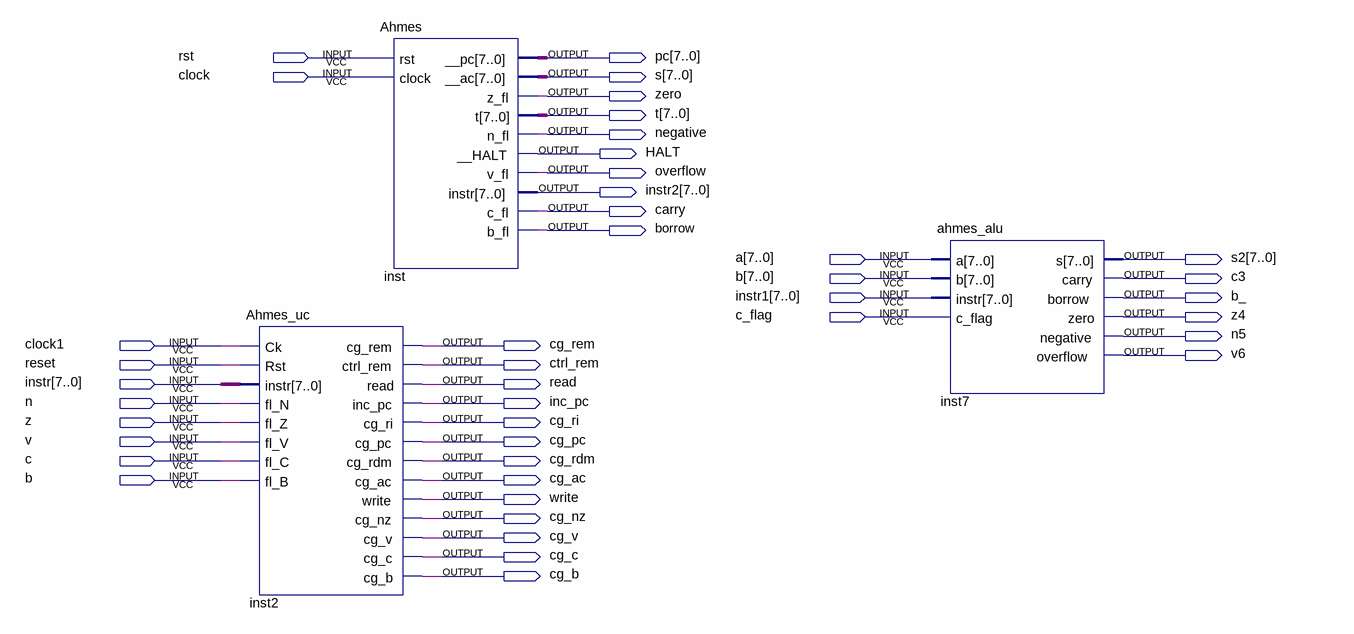
[diagram p0: schematic sheet]
// Quartus schematic Block14.bdf as structural Verilog: 3 symbols, 43 pins
module Block14 (
  input  rst,
  input  clock,
  input  [7:0] a,
  input  [7:0] b,
  input  [7:0] instr1,
  input  c_flag,
  input  clock1,
  input  reset,
  input  [7:0] instr,
  input  n,
  input  z,
  input  v,
  input  c,
  input  b_1bit,
  output [7:0] pc,
  output [7:0] s,
  output zero,
  output [7:0] t,
  output negative,
  output HALT,
  output overflow,
  output [7:0] instr2,
  output carry,
  output borrow,
  output [7:0] s2,
  output c3,
  output b_,
  output z4,
  output n5,
  output cg_rem,
  output v6,
  output ctrl_rem,
  output read,
  output inc_pc,
  output cg_ri,
  output cg_pc,
  output cg_rdm,
  output cg_ac,
  output write,
  output cg_nz,
  output cg_v,
  output cg_c,
  output cg_b
);

  Ahmes_uc inst2 (
    .Ck(clock1), .Rst(reset), .instr(instr), .fl_N(n), .fl_Z(z), .fl_V(v), .fl_C(c), .fl_B(b_1bit),
    .cg_rem(cg_rem), .ctrl_rem(ctrl_rem), .read(read), .inc_pc(inc_pc), .cg_ri(cg_ri), .cg_pc(cg_pc),
    .cg_rdm(cg_rdm), .cg_ac(cg_ac), .write(write), .cg_nz(cg_nz), .cg_v(cg_v), .cg_c(cg_c), .cg_b(cg_b));
  Ahmes inst (
    .rst(rst), .clock(clock), .__pc(pc), .__ac(s), .z_fl(zero), .t(t), .n_fl(negative), .__HALT(HALT),
    .v_fl(overflow), .instr(instr2), .c_fl(carry), .b_fl(borrow));
  ahmes_alu inst7 (
    .a(a), .b(b), .instr(instr1), .c_flag(c_flag), .s(s2), .carry(c3), .borrow(b_), .zero(z4), .negative(n5),
    .overflow(v6));
endmodule
